# Altium schematic sheet Ther.SchDoc
size A4
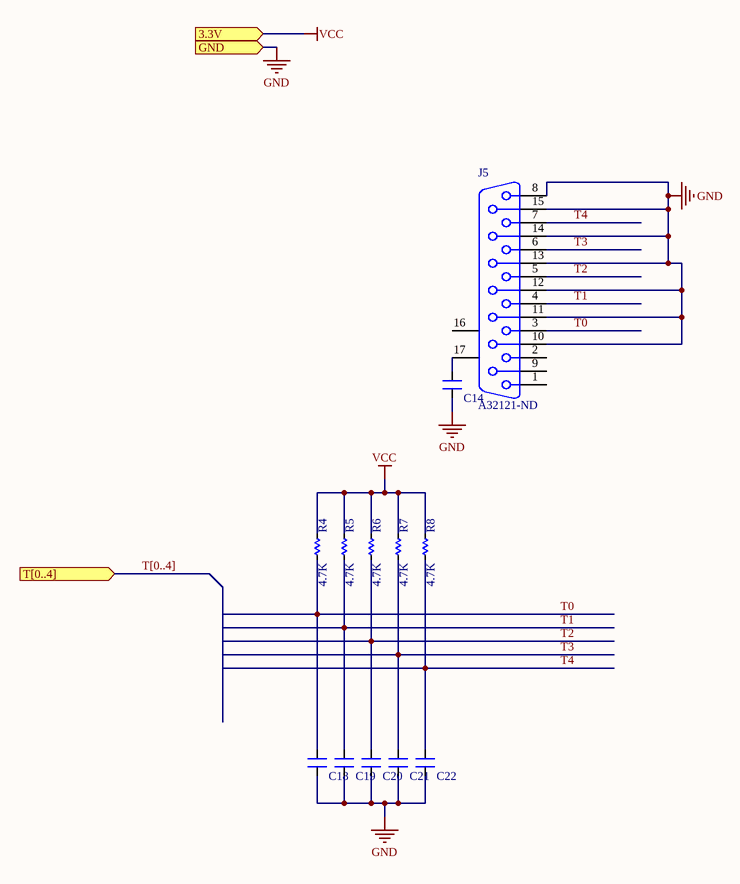
[diagram p0: Ther.SchDoc]

## Parts
C14  10uF  [CN-SMD-0603_big]  (value not drawn)
C18  10uF  [CN-SMD-0603_big]  (value not drawn)
C19  10uF  [CN-SMD-0603_big]  (value not drawn)
C20  10uF  [CN-SMD-0603_big]  (value not drawn)
C21  10uF  [CN-SMD-0603_big]  (value not drawn)
C22  10uF  [CN-SMD-0603_big]  (value not drawn)
J5  A32121-ND  [DB15]
R4  4.7K  [RES-SMD-0603_BIG]
R5  4.7K  [RES-SMD-0603_BIG]
R6  4.7K  [RES-SMD-0603_BIG]
R7  4.7K  [RES-SMD-0603_BIG]
R8  4.7K  [RES-SMD-0603_BIG]

## Ports
3.3V (in), GND (in), T[0..4] (in)

## Nets
GND: C14.1 C18.1 C19.1 C20.1 C21.1 C22.1 J5.8 J5.10 J5.11 J5.12 J5.13 J5.14 J5.15 ; port GND
VCC: R4.1 R5.1 R6.1 R7.1 R8.1 ; port 3.3V
T0: C18.2 J5.3 R4.2
T1: C19.2 J5.4 R5.2
T2: C20.2 J5.5 R6.2
T3: C21.2 J5.6 R7.2
T4: C22.2 J5.7 R8.2
NetC14_2: C14.2 J5.17(MH2)

Not connected (* = marked no-connect by the designer): J5 1 2 9 16(MH1)

## Buses and harness runs
bus T[0..4] = port T[0..4]

## Library data of the parts
C14 C18-C22 = CN: Value: 33pF
J5 = DB15: Receptacle Assembly, 15 Position, Right Angle; PackageDocument: O; Positions: 15; Published: 15-Jun-2001; LatestRevisionDate: 17-Jul-2002; LatestRevisionNote: Re-released for DXP Platform.; DatasheetDocument: 1-Sep-99; PackageReference: 788757; Publisher: Altium Limited; Orientation: Right Angle; Gender: Receptacle
R4-R8 = R